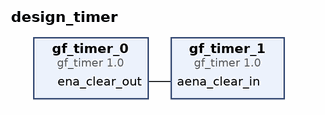
[diagram p0: block diagram of the top level]
# Vivado block design design_timer, xcvu065-ffvc1517-1-i, Vivado 2025.1
create_bd_design design_timer

create_bd_cell -type ip -vlnv user:user:gf_timer:1.0 gf_timer_0
create_bd_cell -type ip -vlnv user:user:gf_timer:1.0 gf_timer_1

# ---- connections ----

connect_bd_net [get_bd_pins gf_timer_0/ena_clear_out] [get_bd_pins gf_timer_1/aena_clear_in]

validate_bd_design
save_bd_design
